# EAGLE design MRCS-CMRI-CMRINet-Adapter (EAGLE 7.7.0)
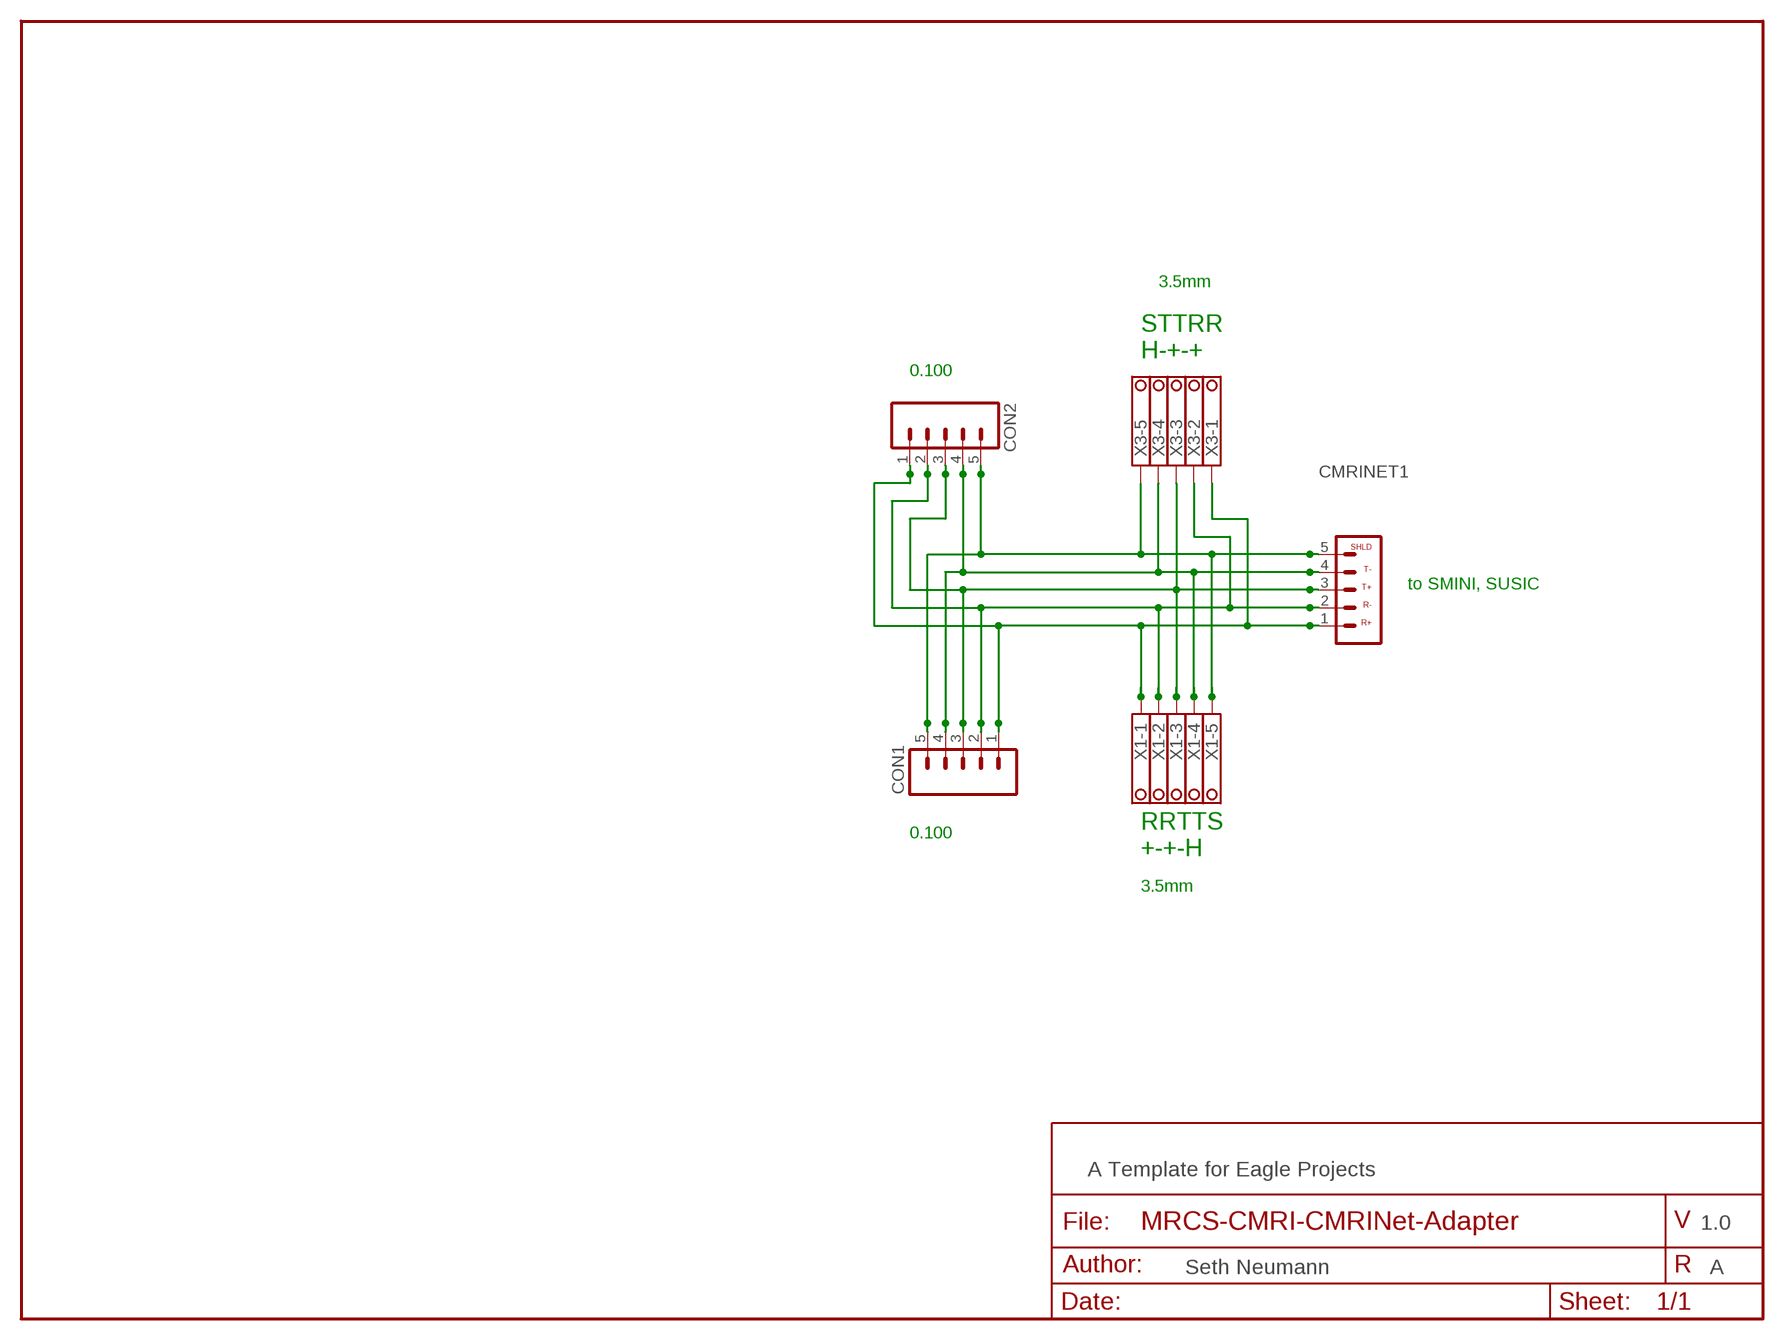
[diagram p0: schematic, sheet 1]

## Parts
CMRINET1  CONNECTOR-CMRINET.156  [KK-156-5]
CON1  CONNECTOR-M05LOCK  [1X05_LOCK]
CON2  CONNECTOR-M05LOCK  [1X05_LOCK]
X1  1751277  [1751277]
X3  1751277  [1751277]

## Nets
R+: CMRINET1.1 CON1.1 CON2.1 X1.1 X3.1
R-: CMRINET1.2 CON1.2 CON2.2 X1.2 X3.2
SHLD: CMRINET1.5 CON1.5 CON2.5 X1.5 X3.5
T+: CMRINET1.3 CON1.3 CON2.3 X1.3 X3.3
T-: CMRINET1.4 CON1.4 CON2.4 X1.4 X3.4

## Notes on the sheet
- 3.5mm
- STTRR
  H-+-+
- 0.100
- to SMINI, SUSIC
- 0.100
- RRTTS
  +-+-H
- 3.5mm
- A Template for Eagle Projects
- 1.0
- Seth Neumann | A

## Library data of the parts
CMRINET1 = SPCoast:CONNECTOR-CMRINET: CMRINet Top 3.5mm Screw Terminal 5 pos
CON1 CON2 = SPCoast:CONNECTOR-M05: Header 5 Standard 5-pin 0.1" header. Use with straight break away headers (SKU : PRT-00116), right angle break away headers (PRT-00553), swiss pins (PRT-00743), machine pins (PRT-00117), and female headers (PRT-00115). Molex polarized connector foot print use with SKU : PRT-08230 with associated crimp pins and housings.
X1 X3 = con-phoenix-350:1751277: MKDS 1/ 5-3,5 Printklemme Nennstrom: 10 A Bemessungsspannung: 160 V Raster: 3,5 mm Polzahl: 5 Montageart: Löten Anschlussart: Schraubanschluss Anschlussrichtung vom Leiter zur Platine: 0° Source: http://eshop.phoenixcontact.com .. 1751277.pdf; OC_FARNELL: unknown; OC_NEWARK: unknown

## Board
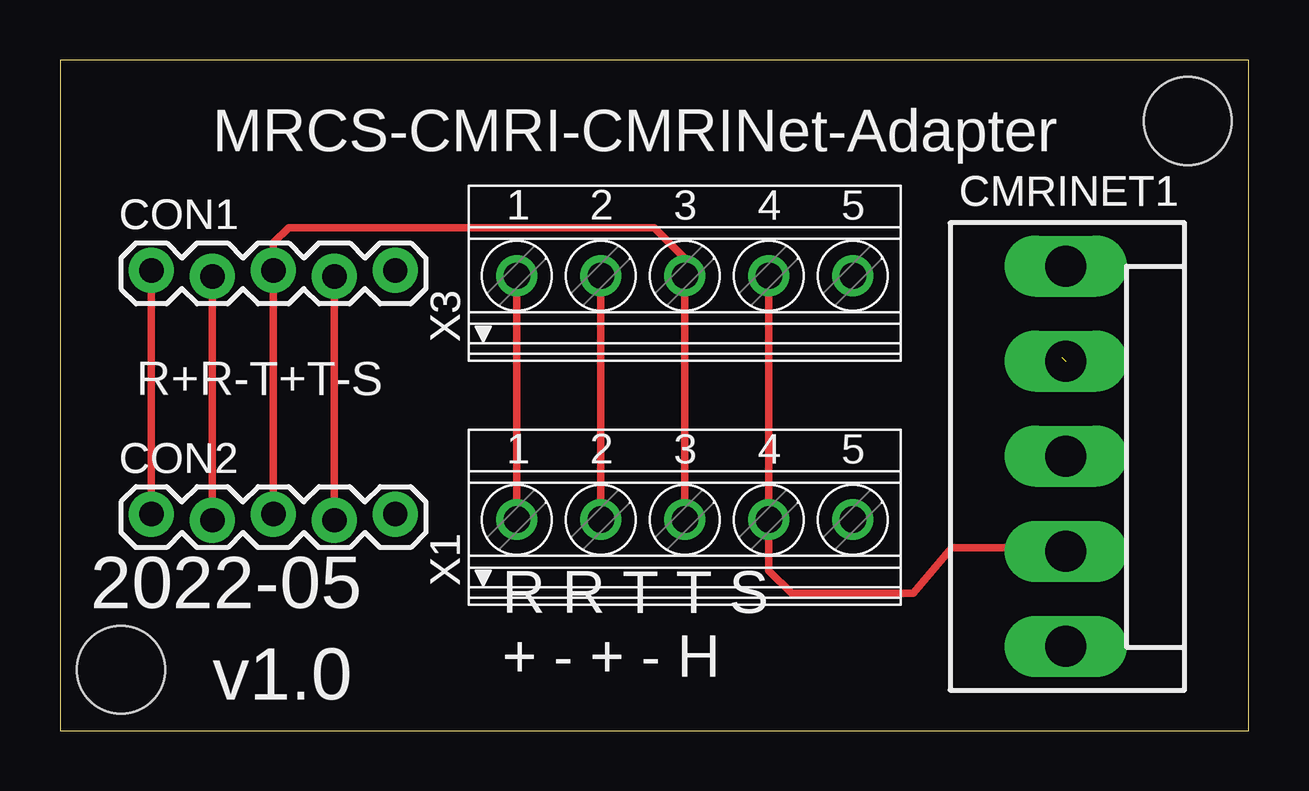
[diagram p1: board, top side]
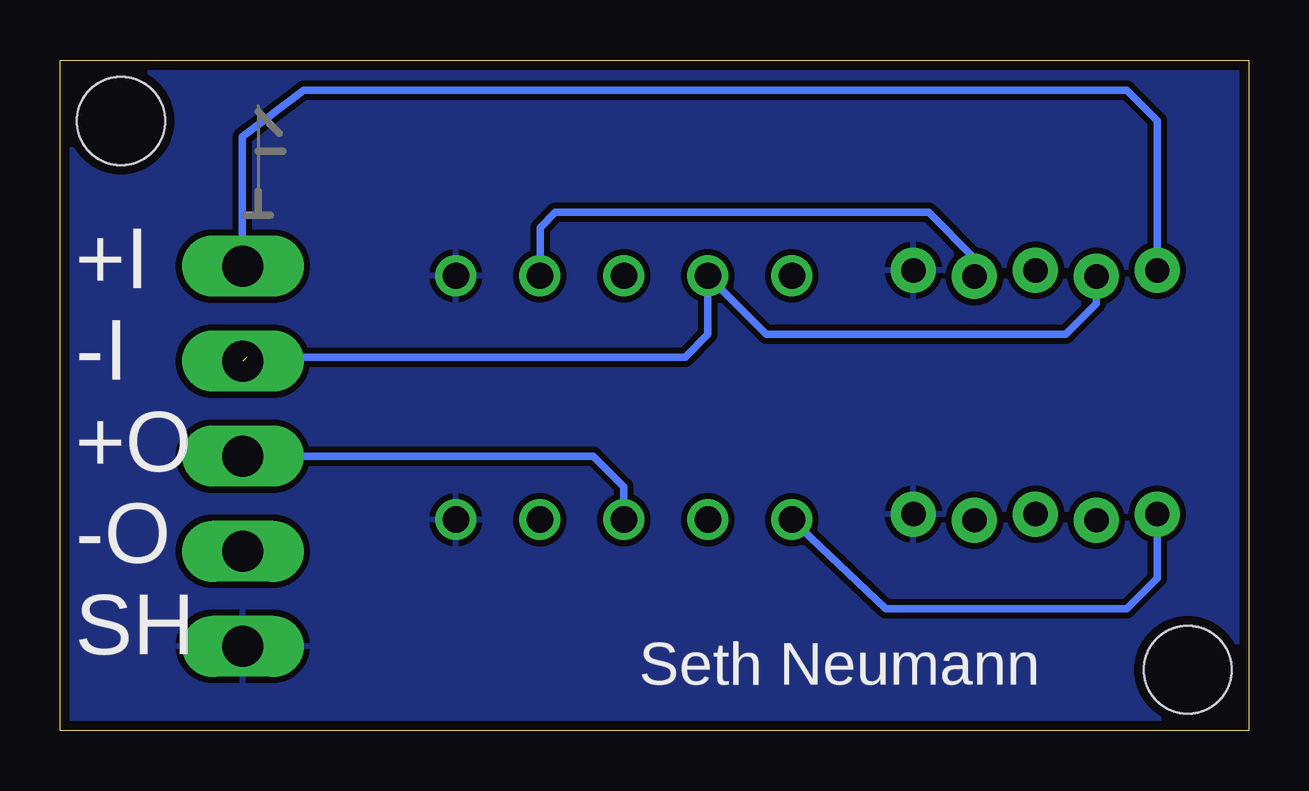
[diagram p2: board, bottom side, seen from below]

Size 49.53 x 27.94 mm. Coordinates in mm from the lower left corner, seen from the top.
Outline: 0,0 49.53,0 49.53,27.94 0,27.94 0,0
Copper layers (1*16): Top 0.035mm / dielectric 1.5mm / Bottom 0.035mm
Design rules "default *": minimum track width 5mil, minimum drill 0.2mm, track to track 5mil, track to pad 5mil, pad to pad 5mil, via to via 5mil, smd to smd 5mil, copper to edge 0.4mm, drill to drill 5mil, minimum pad ring 3mil, minimum via ring 3mil, stop-mask expansion 4mil, vias tented up to drill 0mil, thermal gap 10mil
Holes 3.66 mm at 46.99,25.4 2.54,2.54

### Footprints (pad centres in the part's own frame; a part is rotated, then mirrored left to right if it is on the bottom)
KK-156-5 = drill 1.7 pad 2.184 long: 1 -7.92,0; 2 -3.96,0; 3 0,0; 4 3.96,0; 5 7.92,0
1X05_LOCK = drill 1.016 pad 1.88: 1 0,0.127; 2 2.54,-0.127; 3 5.08,0.127; 4 7.62,-0.127; 5 10.16,0.127
1751277 = drill 1.1 pad 1.7: 1 -7,-0.1; 2 -3.5,-0.1; 3 0,-0.1; 4 3.5,-0.1; 5 7,-0.1

### Placement (x,y rotation side)
CMRINET1  41.91,11.43 270 top
CON1  3.81,19.05 0 top
CON2  3.81,8.89 0 top
U$1  [CA-PROP65WARNING]  27.94,14.61 0 top
U$2  [MRCSLOGOBTM]  34.92,20.95 0 top
X1  26.04,8.89 0 top
X3  26.04,19.05 0 top

### Tracks (layer width: path | path; a pad name or v marks a point on that pad's centre or on a via)
R+
  Top 0.305: CON1.1 CON2.1 | X3.1 X1.1
  Bottom 0.305: CON1.1 3.81,25.4 5.08,26.67 39.37,26.67 41.94,24.73 41.94,19.38 CMRINET1.1 | CON2.1 3.81,6.35 5.08,5.08 15.12,5.08 X1.1
R-  (1 unrouted)
  Top 0.305: CON1.2 CON2.2 | X3.2 X1.2
  Bottom 0.305: 41.74,15.56 23.49,15.56 22.54,16.51 X3.2 20.09,16.51 7.62,16.51 6.35,17.78 CON1.2
SHLD
  pour Bottom (isolate 0.254): 0,0 49.53,0 49.53,27.94 0,27.94
T+
  Top 0.305: CON2.3 CON1.3 8.89,20.32 9.53,20.95 24.77,20.95 26.04,19.68 X3.3 X1.3
  Bottom 0.305: CMRINET1.3 27.3,11.43 26.04,10.16 X1.3
T-
  Top 0.305: CON1.4 CON2.4 | X3.4 X1.4 29.54,6.66 30.48,5.71 35.56,5.71 37.15,7.62 41.76,7.62 CMRINET1.4
  Bottom 0.305: CON1.4 11.43,19.68 13.34,21.59 28.89,21.59 29.53,20.95 29.53,18.96 X3.4

### Text on the board
tPlace: R+R-T+T-S | 2022-05 | R R T T S / + - + - H | v1.0
bPlace: +I / -I / +O / -O / SH | Seth Neumann
_tNames: CMRINET1 | CON1 | X3 | CON2 | X1